# EAGLE schematic Melody (EAGLE 6.5.0)
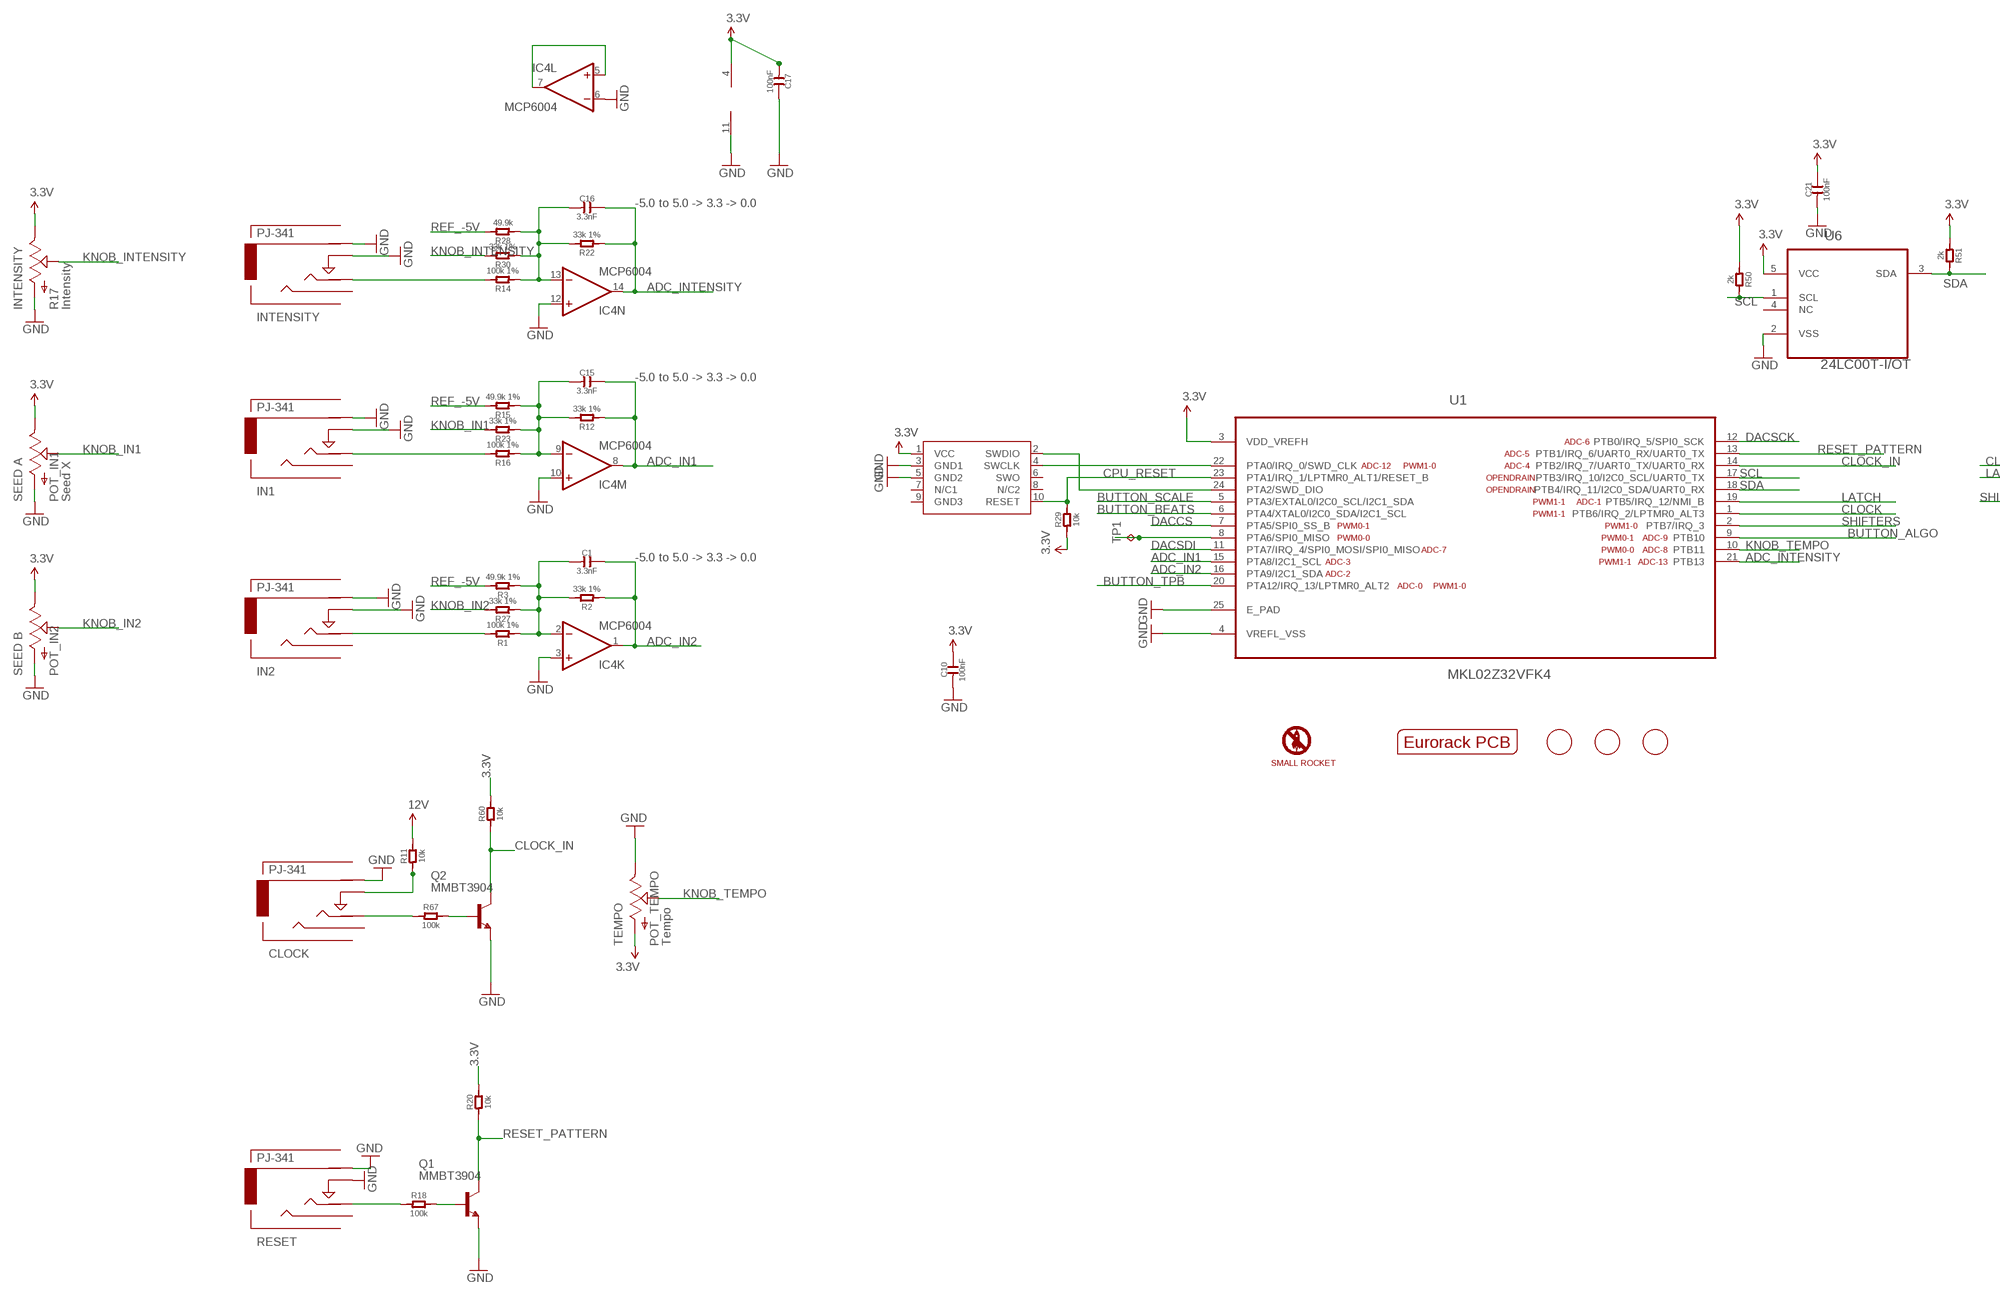
[diagram p0: schematic, sheet 1, part 1 of 2]
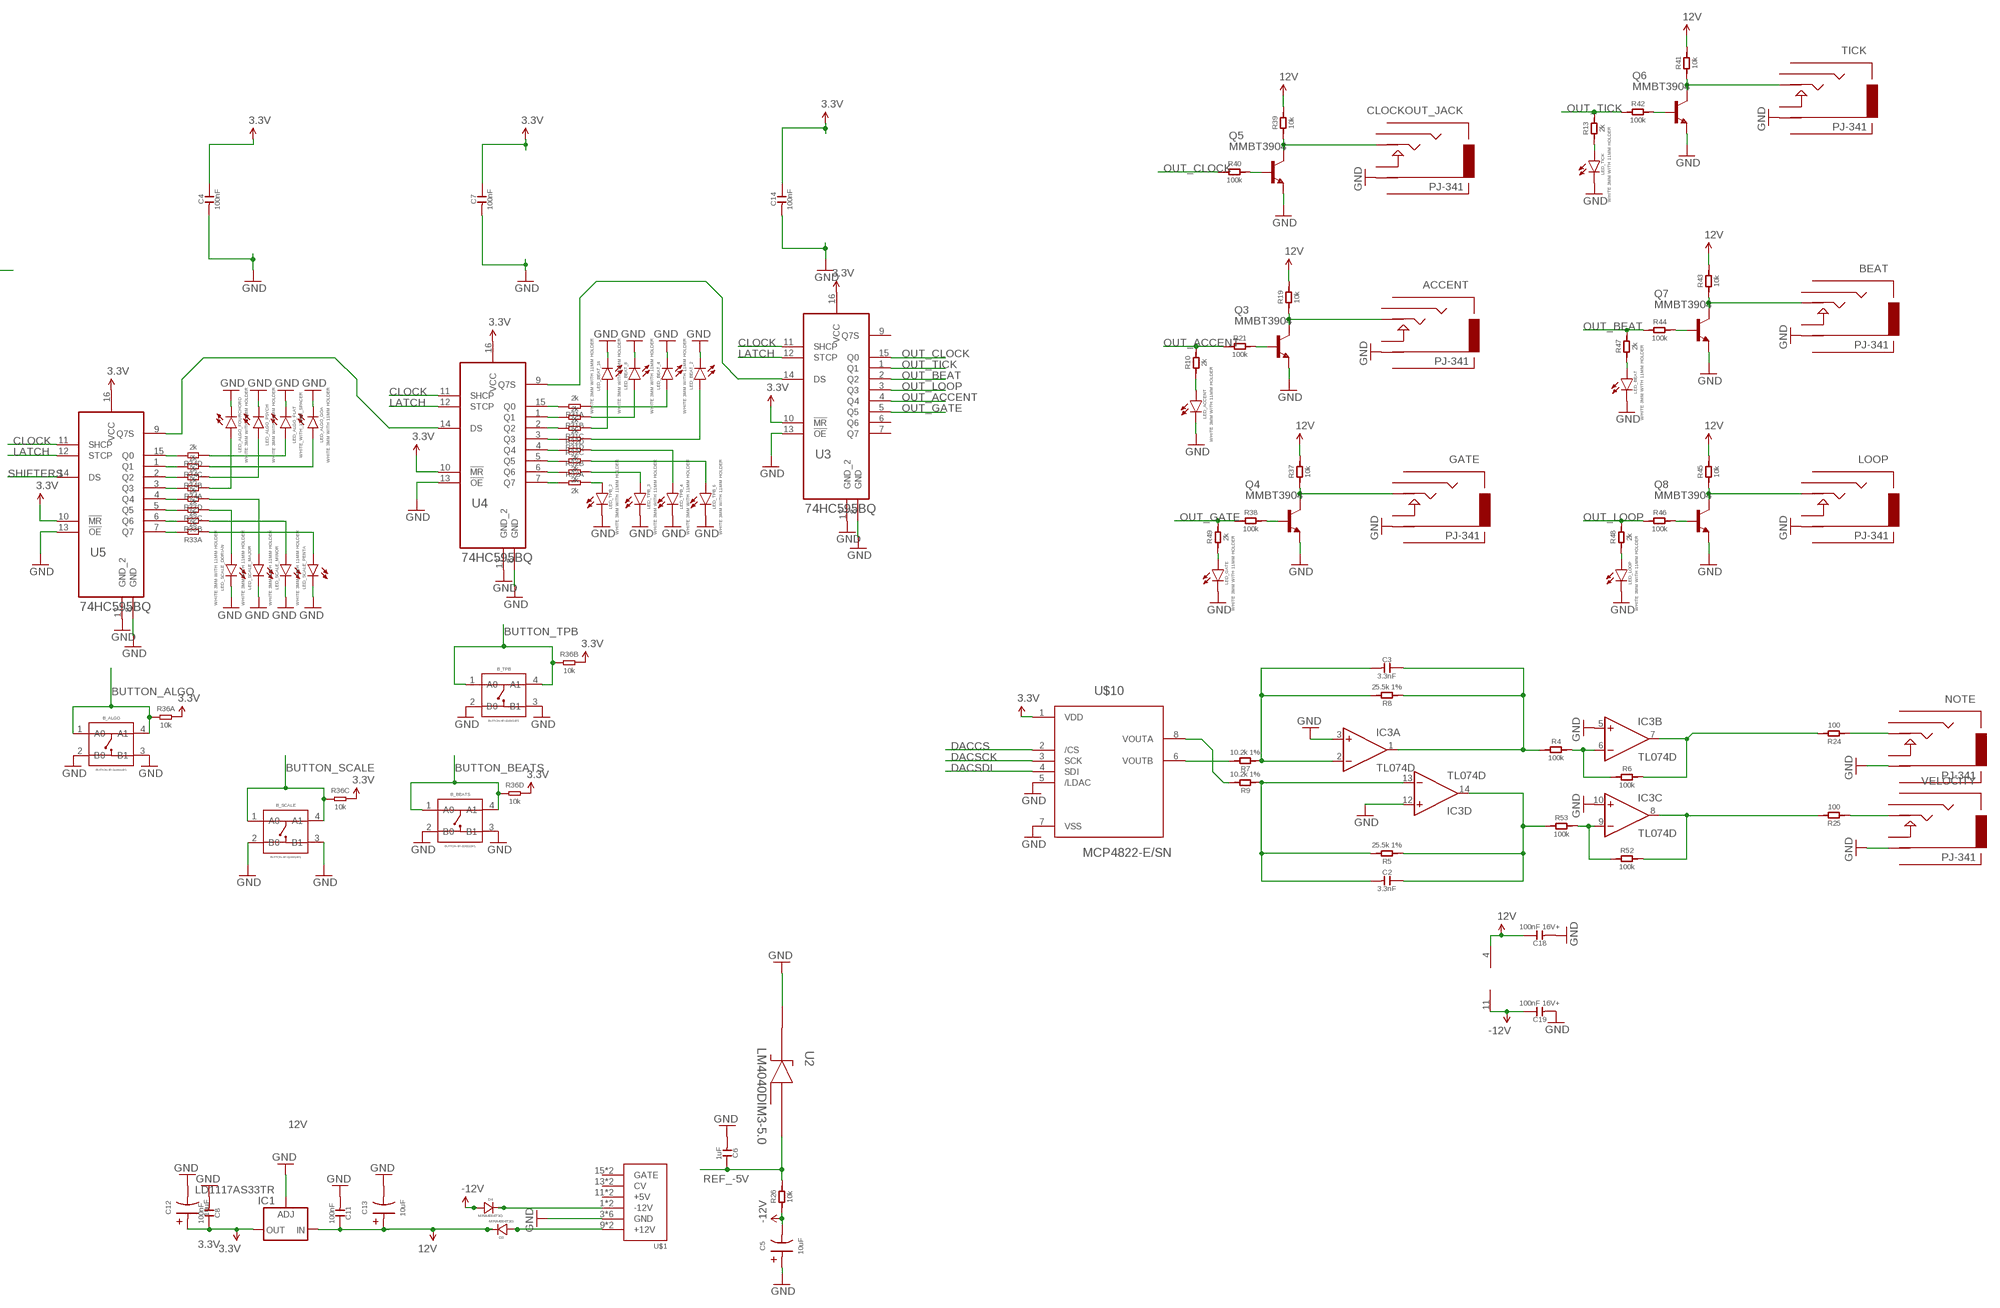
[diagram p1: schematic, sheet 1, part 2 of 2]

## Parts
ACCENT  PJ-341  AUDIO-JACKOUTPUT  [3.5MM-JACK-SWITCH-13MM-OUTPUT]
B_ALGO  BUTTON-4P-3100010P1  [4P-SMD-6.0X6.0X5.0H]
B_BEATS  BUTTON-4P-3100010P1  [4P-SMD-6.0X6.0X5.0H]
B_SCALE  BUTTON-4P-3100010P1  [4P-SMD-6.0X6.0X5.0H]
B_TPB  BUTTON-4P-3100010P1  [4P-SMD-6.0X6.0X5.0H]
BEAT  PJ-341  AUDIO-JACKOUTPUT  [3.5MM-JACK-SWITCH-13MM-OUTPUT]
C1  3.3nF  C-0603  [C0603]
C2  3.3nF  C-0603  [C0603]
C3  3.3nF  C-0603  [C0603]
C4  100nF  C-0603  [C0603]
C5  10uF  C-POLAR-A  [AVX-A]
C6  1uF  C-0603  [C0603]
C7  100nF  C-0603  [C0603]
C8  100nF  C-0603  [C0603]
C10  100nF  C-0603  [C0603]
C11  100nF  C-0603  [C0603]
C12  10uF  C-POLAR-A  [AVX-A]
C13  10uF  C-POLAR-A  [AVX-A]
C14  100nF  C-0603  [C0603]
C15  3.3nF  C-0603  [C0603]
C16  3.3nF  C-0603  [C0603]
C17  100nF  C-0603  [C0603]
C18  100nF 16V+  C-0603  [C0603]
C19  100nF 16V+  C-0603  [C0603]
C21  100nF  C-0603  [C0603]
CLOCK  PJ-341  AUDIO-JACKINPUT  [3.5MM-JACK-SWITCH-13MM-INPUT]
CLOCKOUT_JACK  PJ-341  AUDIO-JACKOUTPUT  [3.5MM-JACK-SWITCH-13MM-OUTPUT]
D3  MRA4004T3G  D-SMA  [DO-214AC]
D4  MRA4004T3G  D-SMA  [DO-214AC]
GATE  PJ-341  AUDIO-JACKOUTPUT  [3.5MM-JACK-SWITCH-13MM-OUTPUT]
IC1  LD1117AS33TR  [SOT223]
IC3  TL074D  [SO14]
IC4  MCP6004  [SO14]
IN1  PJ-341  AUDIO-JACKINPUT  [3.5MM-JACK-SWITCH-13MM-INPUT]
IN2  PJ-341  AUDIO-JACKINPUT  [3.5MM-JACK-SWITCH-13MM-INPUT]
INTENSITY  PJ-341  AUDIO-JACKINPUT  [3.5MM-JACK-SWITCH-13MM-INPUT]
LED_ACCENT  WHITE 3MM WITH 11MM HOLDER  LED3MM  [LED3MM]
LED_ALGO_FLAT  WHITE_WITH_11MM_SPACER  LED3MM  [LED3MM]
LED_ALGO_FOURCHORD  WHITE 3MM WITH 11MM HOLDER  LED3MM  [LED3MM]
LED_ALGO_GOA  WHITE 3MM WITH 11MM HOLDER  LED3MM  [LED3MM]
LED_ALGO_PSYCH  WHITE 3MM WITH 11MM HOLDER  LED3MM  [LED3MM]
LED_BEAT  WHITE 3MM WITH 11MM HOLDER  LED3MM  [LED3MM]
LED_BEAT_2  WHITE 3MM WITH 11MM HOLDER  LED3MM  [LED3MM]
LED_BEAT_4  WHITE 3MM WITH 11MM HOLDER  LED3MM  [LED3MM]
LED_BEAT_8  WHITE 3MM WITH 11MM HOLDER  LED3MM  [LED3MM]
LED_BEAT_16  WHITE 3MM WITH 11MM HOLDER  LED3MM  [LED3MM]
LED_GATE  WHITE 3MM WITH 11MM HOLDER  LED3MM  [LED3MM]
LED_LOOP  WHITE 3MM WITH 11MM HOLDER  LED3MM  [LED3MM]
LED_SCALE_DORIAN  WHITE 3MM WITH 11MM HOLDER  LED3MM  [LED3MM]
LED_SCALE_MAJOR  WHITE 3MM WITH 11MM HOLDER  LED3MM  [LED3MM]
LED_SCALE_MINOR  WHITE 3MM WITH 11MM HOLDER  LED3MM  [LED3MM]
LED_SCALE_PENTA  WHITE 3MM WITH 11MM HOLDER  LED3MM  [LED3MM]
LED_TICK  WHITE 3MM WITH 11MM HOLDER  LED3MM  [LED3MM]
LED_TPB_2  WHITE 3MM WITH 11MM HOLDER  LED3MM  [LED3MM]
LED_TPB_3  WHITE 3MM WITH 11MM HOLDER  LED3MM  [LED3MM]
LED_TPB_4  WHITE 3MM WITH 11MM HOLDER  LED3MM  [LED3MM]
LED_TPB_6  WHITE 3MM WITH 11MM HOLDER  LED3MM  [LED3MM]
LOOP  PJ-341  AUDIO-JACKOUTPUT  [3.5MM-JACK-SWITCH-13MM-OUTPUT]
NOTE  PJ-341  AUDIO-JACKOUTPUT  [3.5MM-JACK-SWITCH-13MM-OUTPUT]
POT_IN1  SEED A  POTZEPHPOT  [OG-POTS_ALPS_POT_VERTICAL]
POT_IN2  SEED B  POTZEPHPOT  [OG-POTS_ALPS_POT_VERTICAL]
POT_TEMPO  TEMPO  POTZEPHPOT  [OG-POTS_ALPS_POT_VERTICAL]
Q1  MMBT3904  MMBT3904LT1-NPN-SOT23-BEC  [SOT23-BEC]
Q2  MMBT3904  MMBT3904LT1-NPN-SOT23-BEC  [SOT23-BEC]
Q3  MMBT3904  MMBT3904LT1-NPN-SOT23-BEC  [SOT23-BEC]
Q4  MMBT3904  MMBT3904LT1-NPN-SOT23-BEC  [SOT23-BEC]
Q5  MMBT3904  MMBT3904LT1-NPN-SOT23-BEC  [SOT23-BEC]
Q6  MMBT3904  MMBT3904LT1-NPN-SOT23-BEC  [SOT23-BEC]
Q7  MMBT3904  MMBT3904LT1-NPN-SOT23-BEC  [SOT23-BEC]
Q8  MMBT3904  MMBT3904LT1-NPN-SOT23-BEC  [SOT23-BEC]
R1  100k 1%  R-0603  [R0603]
R2  33k 1%  R-0603  [R0603]
R3  49.9k 1%  R-0603  [R0603]
R4  100k  R-0603  [R0603]
R5  25.5k 1%  R-0603  [R0603]
R6  100k  R-0603  [R0603]
R7  10.2k 1%  R-0603  [R0603]
R8  25.5k 1%  R-0603  [R0603]
R9  10.2k 1%  R-0603  [R0603]
R10  2k  R-0603  [R0603]
R11  10k  R-0603  [R0603]
R12  33k 1%  R-0603  [R0603]
R13  2k  R-0603  [R0603]
R14  100k 1%  R-0603  [R0603]
R15  49.9k 1%  R-0603  [R0603]
R16  100k 1%  R-0603  [R0603]
R17  INTENSITY  POTZEPHPOT  [OG-POTS_ALPS_POT_VERTICAL]
R18  100k  R-0603  [R0603]
R19  10k  R-0603  [R0603]
R20  10k  R-0603  [R0603]
R21  100k  R-0603  [R0603]
R22  33k 1%  R-0603  [R0603]
R23  33k 1%  R-0603  [R0603]
R24  100  R-0603  [R0603]
R25  100  R-0603  [R0603]
R26  10k  R-0603  [R0603]
R27  33k 1%  R-0603  [R0603]
R28  49.9k  R-0603  [R0603]
R29  10k  R-0603  [R0603]
R30  33k 1%  R-0603  [R0603]
R31  2k  R-4R  [R1206-8]
R32  2k  R-4R  [R1206-8]
R33  2k  R-4R  [R1206-8]
R34  2k  R-4R  [R1206-8]
R36  10k  R-4R  [R1206-8]
R37  10k  R-0603  [R0603]
R38  100k  R-0603  [R0603]
R39  10k  R-0603  [R0603]
R40  100k  R-0603  [R0603]
R41  10k  R-0603  [R0603]
R42  100k  R-0603  [R0603]
R43  10k  R-0603  [R0603]
R44  100k  R-0603  [R0603]
R45  10k  R-0603  [R0603]
R46  100k  R-0603  [R0603]
R47  2k  R-0603  [R0603]
R48  2k  R-0603  [R0603]
R49  2k  R-0603  [R0603]
R50  2k  R-0603  [R0603]
R51  2k  R-0603  [R0603]
R52  100k  R-0603  [R0603]
R53  100k  R-0603  [R0603]
R60  10k  R-0603  [R0603]
R67  100k  R-0603  [R0603]
RESET  PJ-341  AUDIO-JACKINPUT  [3.5MM-JACK-SWITCH-13MM-INPUT]
SWD1  CORTEX_SWD  [M50-3600542]
TICK  PJ-341  AUDIO-JACKOUTPUT  [3.5MM-JACK-SWITCH-13MM-OUTPUT]
TP1  TPB1,27  [B1,27]
U1  MKL02Z32VFK4  [QFN50P400X400X100-25N]
U2  LM4040DIM3-5.0  [SOT95P237X112-3N]
U3  74HC595BQ  [QFN50P250X350X100-17N]
U4  74HC595BQ  [QFN50P250X350X100-17N]
U5  74HC595BQ  [QFN50P250X350X100-17N]
U6  24LC00T-I/OT  [SOT95P290X145-5N]
U$1  POWER  [POWER_16]
U$2  EURORACK_PCB12HP  [EURORACK12HPPCB]
U$4  FIDUCIAL  [FIDUCIAL_1MM]
U$7  FIDUCIAL  [FIDUCIAL_1MM]
U$8  FIDUCIAL  [FIDUCIAL_1MM]
U$10  MCP4822-E/SN  [SOIC8-N_MC]
U$19  SMALLROCKET  [SMALLROCKET]
VELOCITY  PJ-341  AUDIO-JACKOUTPUT  [3.5MM-JACK-SWITCH-13MM-OUTPUT]

## Nets
3.3V [mediumpower]: C4.2 C7.2 C8.2 C10.2 C12.+ C14.2 C17.1 C21.2 IC1.2(OUT) IC1.4(OUT) IC4.4(O:V+) POT_IN1.P$1(E) POT_IN2.P$1(E) POT_TEMPO.P$3(A) R17.P$1(E) R20.2 R29.1 R36.5 R36.6 R36.7 R36.8 R50.1 R51.1 R60.2 SWD1.1(VCC) U1.3(VDD_VREFH) U3.10(!MR) U3.16(VCC) U4.10(!MR) U4.16(VCC) U5.10(!MR) U5.16(VCC) U6.5(VCC) U$10.1(VDD)
12V [heavypower]: C11.2 C13.+ C18.2 D3.2(-) IC1.3(IN) IC3.4(P:V+) R11.2 R19.2 R37.2 R39.2 R41.2 R43.2 R45.2
-12V [heavypower]: C5.- C19.2 D4.1(+) IC3.11(P:V-) R26.1
ADC_IN1: C15.2 IC4.8(M:OUT) R12.1 U1.15(PTA8/I2C1_SCL)
ADC_IN2: C1.2 IC4.1(K:OUT) R2.1 U1.16(PTA9/I2C1_SDA)
ADC_INTENSITY: C16.2 IC4.14(N:OUT) R22.1 U1.21(PTB13)
BUTTON_ALGO: B_ALGO.1(A0) B_ALGO.4(A1) R36.1 U1.9(PTB10)
BUTTON_BEATS: B_BEATS.1(A0) B_BEATS.4(A1) R36.4 U1.6(PTA4/XTAL0/I2C0_SDA/I2C1_SCL)
BUTTON_SCALE: B_SCALE.1(A0) B_SCALE.4(A1) R36.3 U1.5(PTA3/EXTAL0/I2C0_SCL/I2C1_SDA)
BUTTON_TPB: B_TPB.1(A0) B_TPB.4(A1) R36.2 U1.20(PTA12/IRQ_13/LPTMR0_ALT2)
CLOCK: U1.1(PTB6/IRQ_2/LPTMR0_ALT3) U3.11(SHCP) U4.11(SHCP) U5.11(SHCP)
CLOCK_IN: Q2.C R60.1 U1.14(PTB2/IRQ_7/UART0_TX/UART0_RX)
CPU_RESET: R29.2 SWD1.10(RESET) U1.23(PTA1/IRQ_1/LPTMR0_ALT1/RESET_B)
DACCS: U1.7(PTA5/SPI0_SS_B) U$10.2(/CS)
DACSCK: U1.12(PTB0/IRQ_5/SPI0_SCK) U$10.3(SCK)
DACSDI: U1.11(PTA7/IRQ_4/SPI0_MOSI/SPI0_MISO) U$10.4(SDI)
GND [mediumpower]: ACCENT.RING@3(RING) B_ALGO.2(B0) B_ALGO.3(B1) B_BEATS.2(B0) B_BEATS.3(B1) B_SCALE.2(B0) B_SCALE.3(B1) B_TPB.2(B0) B_TPB.3(B1) BEAT.RING@3(RING) C4.1 C5.+ C6.1 C7.1 C8.1 C10.1 C11.1 C12.- C13.- C14.1 C17.2 C18.1 C19.1 C21.1 CLOCK.RING@3(RING) CLOCKOUT_JACK.RING@3(RING) GATE.RING@3(RING) IC1.1(ADJ) IC3.3(A:+IN) IC3.5(B:+IN) IC3.10(C:+IN) IC3.12(D:+IN) IC4.3(K:+IN) IC4.6(L:-IN) IC4.10(M:+IN) IC4.11(O:V-) IC4.12(N:+IN) IN1.RING@3(RING) IN1.SWITCH@3(SWITCH) IN2.RING@3(RING) IN2.SWITCH@3(SWITCH) INTENSITY.RING@3(RING) INTENSITY.SWITCH@3(SWITCH) LED_ACCENT.K(C) LED_ALGO_FLAT.K(C) LED_ALGO_FOURCHORD.K(C) LED_ALGO_GOA.K(C) LED_ALGO_PSYCH.K(C) LED_BEAT.K(C) LED_BEAT_2.K(C) LED_BEAT_4.K(C) LED_BEAT_8.K(C) LED_BEAT_16.K(C) LED_GATE.K(C) LED_LOOP.K(C) LED_SCALE_DORIAN.K(C) LED_SCALE_MAJOR.K(C) LED_SCALE_MINOR.K(C) LED_SCALE_PENTA.K(C) LED_TICK.K(C) LED_TPB_2.K(C) LED_TPB_3.K(C) LED_TPB_4.K(C) LED_TPB_6.K(C) LOOP.RING@3(RING) NOTE.RING@3(RING) POT_IN1.P$3(A) POT_IN2.P$3(A) POT_TEMPO.P$1(E) Q1.E Q2.E Q3.E Q4.E Q5.E Q6.E Q7.E Q8.E R17.P$3(A) RESET.RING@3(RING) RESET.SWITCH@3(SWITCH) SWD1.3(GND1) SWD1.5(GND2) TICK.RING@3(RING) U1.4(VREFL_VSS) U1.25(E_PAD) U2.1(CATHODE) U3.8(GND) U3.13(!OE) U3.17(GND_2) U4.8(GND) U4.13(!OE) U4.17(GND_2) U5.8(GND) U5.13(!OE) U5.17(GND_2) U6.2(VSS) U$1.3(GND) U$1.4(GND) U$1.5(GND) U$1.6(GND) U$1.7(GND) U$1.8(GND) U$10.5(/LDAC) U$10.7(VSS) VELOCITY.RING@3(RING)
KNOB_IN1: POT_IN1.P$2(S) R23.2
KNOB_IN2: POT_IN2.P$2(S) R27.2
KNOB_INTENSITY: R17.P$2(S) R30.2
KNOB_TEMPO: POT_TEMPO.P$2(S) U1.10(PTB11)
LATCH: U1.19(PTB5/IRQ_12/NMI_B) U3.12(STCP) U4.12(STCP) U5.12(STCP)
N$1: R31.7 U4.1(Q1)
N$2: IC3.6(B:-IN) R4.2 R6.1
N$3: IN1.TIP@3(TIP) R16.2
N$4: C15.1 IC4.9(M:-IN) R12.2 R15.1 R16.1 R23.1
N$5: R9.2 U$10.8(VOUTA)
N$6: IN2.TIP@3(TIP) R1.2
N$7: R7.2 U$10.6(VOUTB)
N$8: C1.1 IC4.2(K:-IN) R1.1 R2.2 R3.1 R27.1
N$9: C2.1 IC3.13(D:-IN) R5.2 R9.1
N$10: C3.1 IC3.2(A:-IN) R7.1 R8.2
N$13 [heavypower]: D3.1(+) U$1.9(+12V) U$1.10(+12V)
N$14: IC3.7(B:OUT) R6.2 R24.2
N$15: Q1.B R18.2
N$16: R18.1 RESET.TIP@3(TIP)
N$17: IC3.9(C:-IN) R52.1 R53.2
N$18: C3.2 IC3.1(A:OUT) R4.1 R8.1
N$19: R31.6 U4.2(Q2)
N$20: R25.1 VELOCITY.TIP@3(TIP)
N$21: NOTE.TIP@3(TIP) R24.1
N$24: C2.2 IC3.14(D:OUT) R5.1 R53.1
N$25: Q3.B R21.2
N$26: R31.5 U4.3(Q3)
N$27: R32.4 U4.4(Q4)
N$28: LED_SCALE_DORIAN.A R33.6
N$29: ACCENT.TIP@3(TIP) Q3.C R19.1
N$30: R32.3 U4.5(Q5)
N$31: R32.2 U4.6(Q6)
N$32: LED_SCALE_MAJOR.A R33.5
N$33: INTENSITY.TIP@3(TIP) R14.2
N$34: C16.1 IC4.13(N:-IN) R14.1 R22.2 R28.1 R30.1
N$35: R32.1 U4.7(Q7)
N$36: R31.8 U4.15(Q0)
N$37: R34.4 U5.15(Q0)
N$38: R34.3 U5.1(Q1)
N$39: R34.2 U5.2(Q2)
N$40: R34.1 U5.3(Q3)
N$41: R33.4 U5.4(Q4)
N$42: R33.3 U5.5(Q5)
N$43: CLOCK.TIP@3(TIP) R67.1
N$48: R33.2 U5.6(Q6)
N$49: R33.1 U5.7(Q7)
N$57: Q4.B R38.2
N$58: GATE.TIP@3(TIP) Q4.C R37.1
N$60: Q5.B R40.2
N$61: CLOCKOUT_JACK.TIP@3(TIP) Q5.C R39.1
N$63: Q6.B R42.2
N$64 [heavypower]: D4.2(-) U$1.1(-12V) U$1.2(-12V)
N$65: Q6.C R41.1 TICK.TIP@3(TIP)
N$66: Q2.B R67.2
N$68: Q7.B R44.2
N$69: BEAT.TIP@3(TIP) Q7.C R43.1
N$71: Q8.B R46.2
N$72: LOOP.TIP@3(TIP) Q8.C R45.1
N$73: LED_ALGO_GOA.A R34.6
N$74: LED_ALGO_FLAT.A R34.5
N$75: LED_ALGO_PSYCH.A R34.7
N$76: LED_ALGO_FOURCHORD.A R34.8
N$77: LED_SCALE_MINOR.A R33.7
N$78: LED_SCALE_PENTA.A R33.8
N$79: LED_BEAT_16.A R31.3
N$80: LED_BEAT_8.A R31.2
N$81: LED_BEAT_4.A R31.1
N$82: LED_BEAT_2.A R31.4
N$83: LED_TPB_2.A R32.8
N$84: LED_TPB_3.A R32.7
N$85: LED_TPB_4.A R32.5
N$86: LED_TPB_6.A R32.6
N$88: U4.14(DS) U5.9(Q7S)
N$89: U3.14(DS) U4.9(Q7S)
N$90: LED_TICK.A R13.1
N$91: LED_LOOP.A R48.1
N$92: LED_GATE.A R49.1
N$93: LED_BEAT.A R47.1
N$94: IC3.8(C:OUT) R25.2 R52.2
N$95: LED_ACCENT.A R10.1
N$96: CLOCK.SWITCH@3(SWITCH) R11.1
N$97: IC4.5(L:+IN) IC4.7(L:OUT)
OUT_ACCENT: R10.2 R21.1 U3.4(Q4)
OUT_BEAT: R44.1 R47.2 U3.2(Q2)
OUT_CLOCK: R40.1 U3.15(Q0)
OUT_GATE: R38.1 R49.2 U3.5(Q5)
OUT_LOOP: R46.1 R48.2 U3.3(Q3)
OUT_TICK: R13.2 R42.1 U3.1(Q1)
PTA6: TP1.TP U1.8(PTA6/SPI0_MISO)
REF_-5V: C6.2 R3.2 R15.2 R26.2 R28.2 U2.2(ANODE)
RESET_PATTERN: Q1.C R20.1 U1.13(PTB1/IRQ_6/UART0_RX/UART0_TX)
SCL: R50.2 U1.17(PTB3/IRQ_10/I2C0_SCL/UART0_TX) U6.1(SCL)
SDA: R51.2 U1.18(PTB4/IRQ_11/I2C0_SDA/UART0_RX) U6.3(SDA)
SHIFTERS: U1.2(PTB7/IRQ_3) U5.14(DS)
SWD_CLK: SWD1.4(SWCLK) U1.22(PTA0/IRQ_0/SWD_CLK)
SWD_DIO: SWD1.2(SWDIO) U1.24(PTA2/SWD_DIO)
Unconnected: ACCENT.SECOND@3(SECOND) ACCENT.SWITCH@3(SWITCH) BEAT.SECOND@3(SECOND) BEAT.SWITCH@3(SWITCH) CLOCK.SECOND@3(SECOND) CLOCKOUT_JACK.SECOND@3(SECOND) CLOCKOUT_JACK.SWITCH@3(SWITCH) GATE.SECOND@3(SECOND) GATE.SWITCH@3(SWITCH) IN1.SECOND@3(SECOND) IN2.SECOND@3(SECOND) INTENSITY.SECOND@3(SECOND) LOOP.SECOND@3(SECOND) LOOP.SWITCH@3(SWITCH) NOTE.SECOND@3(SECOND) NOTE.SWITCH@3(SWITCH) RESET.SECOND@3(SECOND) SWD1.6(SWO) SWD1.7(N/C1) SWD1.8(N/C2) SWD1.9(GND3) TICK.SECOND@3(SECOND) TICK.SWITCH@3(SWITCH) U2.3(NC) U3.6(Q6) U3.7(Q7) U3.9(Q7S) U6.4(NC) U$1.11(+5V) U$1.12(+5V) U$1.13(CV) U$1.14(CV) U$1.15(GATE) U$1.16(GATE) VELOCITY.SECOND@3(SECOND) VELOCITY.SWITCH@3(SWITCH)

## Notes on the sheet
- -5.0 to 5.0 -> 3.3 -> 0.0
- -5.0 to 5.0 -> 3.3 -> 0.0
- -5.0 to 5.0 -> 3.3 -> 0.0

## Library data of the parts
ACCENT = EurorackModularParts:AUDIO-JACK: Switching Mono 3.5mm Audio Jack from Erthenvar.; DESC: Accent; OC_FARNELL: unknown
B_ALGO = zephod-components:BUTTON-4P; DESC: Algorithm; OC_FARNELL: unknown
B_BEATS = zephod-components:BUTTON-4P; DESC: Beats; OC_FARNELL: unknown
B_SCALE = zephod-components:BUTTON-4P; DESC: Scale; OC_FARNELL: unknown
B_TPB = zephod-components:BUTTON-4P; DESC: Ticks; OC_FARNELL: unknown
BEAT = EurorackModularParts:AUDIO-JACK: Switching Mono 3.5mm Audio Jack from Erthenvar.; DESC: Beat; OC_FARNELL: unknown
C1-C3 C15 C16 = OPL:C*; OC_FARNELL: unknown
C4 C7 C8 C10 C11 C14 C17-C19 C21 = OPL:C*; MF: MULTICOMP; MPN: MC0603F104Z160CT; OC_FARNELL: 1759017
C5 C12 C13 = OPL:C-POLAR*; MF: AVX; MPN: TAJB106K020RNJ; OC_FARNELL: 197427
C6 = OPL:C*; MF: AVX; MPN: 06035C104KAT2A; OC_FARNELL: 1301804
CLOCK = EurorackModularParts:AUDIO-JACK: Switching Mono 3.5mm Audio Jack from Erthenvar.; DESC: Clock; OC_FARNELL: unknown
CLOCKOUT_JACK = EurorackModularParts:AUDIO-JACK: Switching Mono 3.5mm Audio Jack from Erthenvar.; DESC: Clock Out; OC_FARNELL: unknown
D3 D4 = OPL:D*: DIODE; MF: VISHAY; MPN: US1G-E3/5AT; OC_FARNELL: 9551824
GATE = EurorackModularParts:AUDIO-JACK: Switching Mono 3.5mm Audio Jack from Erthenvar.; DESC: Gate; OC_FARNELL: unknown
IC1 = ld-components:LD1117A?*: Low drop fixed and adjustable positive voltage regulators 1 A Source: http://www.st.com/stonline/products/literature/ds/7194/ld1117axx.pdf; MF: STMICROELECTRONICS; MPN: LD1117AS33TR; OC_FARNELL: 1467776
IC3 = EurorackModularParts:TL074: OP AMP; MF: TEXAS INSTRUMENTS; MPN: TL074CD; OC_FARNELL: 1103010
IC4 = EurorackModularParts:MCP6004; MF: MICROCHIP; MPN: MCP6004-I/SL.; OC_FARNELL: 1605572
IN1 = EurorackModularParts:AUDIO-JACK: Switching Mono 3.5mm Audio Jack from Erthenvar.; DESC: Seed X; OC_FARNELL: unknown
IN2 = EurorackModularParts:AUDIO-JACK: Switching Mono 3.5mm Audio Jack from Erthenvar.; DESC: Seed Y; OC_FARNELL: unknown
INTENSITY = EurorackModularParts:AUDIO-JACK: Switching Mono 3.5mm Audio Jack from Erthenvar.; DESC: Intensity; OC_FARNELL: unknown
LED_ACCENT LED_ALGO_FLAT LED_ALGO_FOURCHORD LED_ALGO_GOA LED_ALGO_PSYCH LED_BEAT LED_BEAT_2 LED_BEAT_4 LED_BEAT_8 LED_BEAT_16 LED_GATE LED_LOOP LED_SCALE_DORIAN LED_SCALE_MAJOR LED_SCALE_MINOR LED_SCALE_PENTA LED_TICK LED_TPB_2-LED_TPB_4 LED_TPB_6 = SparkFun-LED:LED: LEDs Standard schematic elements and footprints for 5mm, 3mm, 1206, and 0603 sized LEDs. 5mm - Spark Fun Electronics SKU : COM-00529 (and others); OC_FARNELL: unknown
LOOP = EurorackModularParts:AUDIO-JACK: Switching Mono 3.5mm Audio Jack from Erthenvar.; DESC: Loop; OC_FARNELL: unknown
NOTE = EurorackModularParts:AUDIO-JACK: Switching Mono 3.5mm Audio Jack from Erthenvar.; DESC: Note; OC_FARNELL: unknown
POT_IN1 = EurorackModularParts:POT; DESC: Seed X; OC_FARNELL: unknown
POT_IN2 = EurorackModularParts:POT; DESC: Seed Y; OC_FARNELL: unknown
POT_TEMPO = EurorackModularParts:POT; DESC: Tempo; OC_FARNELL: unknown
Q1-Q8 = transistor:*-NPN-: NPN Transistror BF959 corrected 2008.03.06; MF: NXP; MPN: PMBT3904,215; OC_FARNELL: 2336795
R1-R16 R18-R30 R37-R53 R60 R67 = OPL:R*; OC_FARNELL: unknown
R17 = EurorackModularParts:POT; DESC: Intensity; OC_FARNELL: unknown
R31-R34 R36 = OPL:R-4R*: Resistor Array; OC_FARNELL: unknown
RESET = EurorackModularParts:AUDIO-JACK: Switching Mono 3.5mm Audio Jack from Erthenvar.; DESC: Reset; OC_FARNELL: unknown
SWD1 = carrilib with jtags:CORTEX_SWD: .05" Cortex M Connector in SWD mode Manufacturer: Generic Part Number: Cortex M SWD Notes: I use Harwin M50-3600542 connectors; OC_FARNELL: unknown
TICK = EurorackModularParts:AUDIO-JACK: Switching Mono 3.5mm Audio Jack from Erthenvar.; DESC: Tick; OC_FARNELL: unknown
TP1 = testpad:TP: Test pad; OC_FARNELL: unknown
U1 = FarnellThings:MKL02Z32VFK4: IC, MCU, 32BIT, CORTEX M0+, 48MHZ, QFN-24; MF: NXP; MPN: MKL02Z32VFK4; OC_FARNELL: 2321481; OC_NEWARK: 61W9887; PACKAGE: QFN-24; SUPPLIER: FREESCALE SEMICONDUCTOR
U2 = FarnellThings:LM4040DIM3-5.0: IC, Precision Micropower Shunt Voltage Reference, 5V,SOT-23-3; MF: TEXAS INSTRUMENTS; MPN: LM4040DIM3-5.0; OC_FARNELL: 9778330; OC_NEWARK: 97K3489; PACKAGE: SOT-23-3; SUPPLIER: TEXAS INSTRUMENTS
U3-U5 = FarnellThings:74HC595BQ: 8-bit serial-in, serial or parallel-out shift register,QFN-16; MF: NXP; MPN: 74HC595BQ; OC_FARNELL: 2164850; OC_NEWARK: 43W8000; PACKAGE: QFN-16; SUPPLIER: NXP
U6 = EurorackModularParts:24LC00T-I/OT: IC, EEPROM 128BIT SERIAL 400KHZ SOT-23-5; MF: MICROCHIP; MPN: 24LC00T-I/OT; OC_FARNELL: 9757864; OC_NEWARK: 62K0574; PACKAGE: SOT-23-5; SUPPLIER: MICROCHIP
U$1 = eurorack:POWER; OC_FARNELL: unknown
U$2 = EurorackModularParts:EURORACK_PCB; OC_FARNELL: unknown
U$4 U$7 U$8 = adafruit:FIDUCIAL: For use by pick and place machines to calibrate the vision/machine, 1mm By microbuilder.eu; OC_FARNELL: unknown
U$10 = FarnellThings:MCP4822-E/SN: 12 Bit DAC; DESCRIPTION: 12 Bit DAC; MF: MICROCHIP; MPN: MCP4822-E/SN; OC_FARNELL: 1439414; OC_NEWARK: 31K2975; PACKAGE: SOIC-8; SUPPLIER: Microchip
U$19 = zephod-components:SMALLROCKET; OC_FARNELL: unknown
VELOCITY = EurorackModularParts:AUDIO-JACK: Switching Mono 3.5mm Audio Jack from Erthenvar.; DESC: Velocity; OC_FARNELL: unknown

## Net classes
0 default: width 0.203 mm, clearance 0.203 mm
1 heavypower: width 0.381 mm
2 mediumpower: width 0.254 mm